# EAGLE design combined (EAGLE 9.6.2)

## Sheet 1 of 2
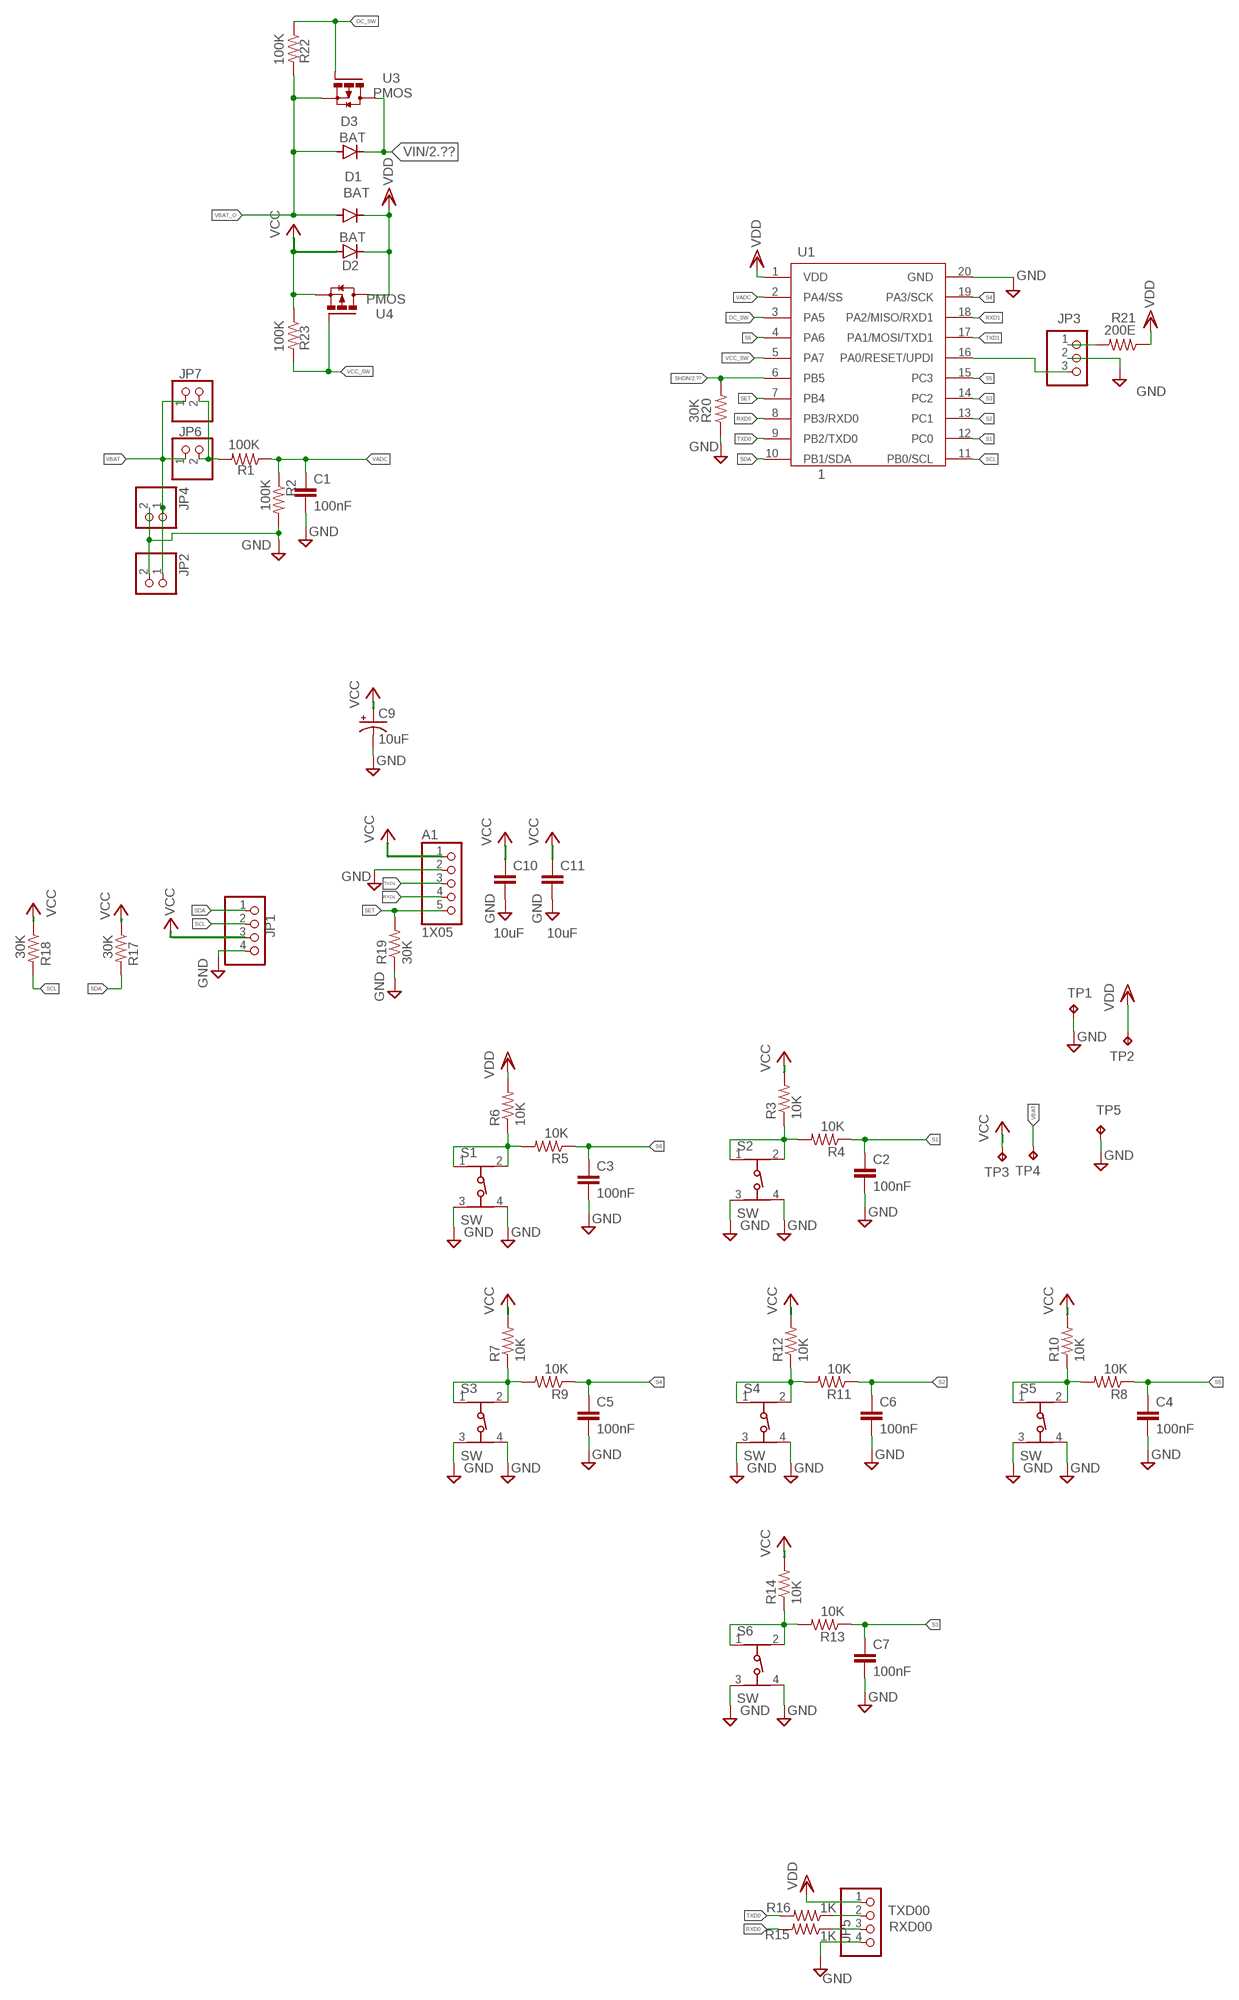
[diagram p0: schematic, sheet 1]

### Parts
A1  1X05  [1X05X254]
C1  100nF  C-EUC0805  [C0805]
C2  100nF  C-EUC0805  [C0805]
C3  100nF  C-EUC0805  [C0805]
C4  100nF  C-EUC0805  [C0805]
C5  100nF  C-EUC0805  [C0805]
C6  100nF  C-EUC0805  [C0805]
C7  100nF  C-EUC0805  [C0805]
C9  10uF  CPOL-USCT3528  [CT3528]
C10  10uF  C-EUC0805  [C0805]
C11  10uF  C-EUC0805  [C0805]
D1  BAT  CGRM4005-G  [SOD-123_MINI-SMA]
D2  BAT  CGRM4005-G  [SOD-123_MINI-SMA]
D3  BAT  CGRM4005-G  [SOD-123_MINI-SMA]
JP1  PINHD-1X04_2.54-S  [1X04-S]
JP2  PINHD-1X02_2.54-S  [1X02-S]
JP3  PINHD-1X03_2.54-S  [1X03-S]
JP4  PINHD-1X02_2.54-S  [1X02-S]
JP5  PINHD-1X04_2.54-S  [1X04-S]
JP6  PINHD-1X02_2.54-S  [1X02-S]
JP7  PINHD-1X02_2.54-S  [1X02-S]
R1  100K  R-US_R0805  [R0805]
R2  100K  R-US_R0805  [R0805]
R3  10K  R-US_R0805  [R0805]
R4  10K  R-US_R0805  [R0805]
R5  10K  R-US_R0805  [R0805]
R6  10K  R-US_R0805  [R0805]
R7  10K  R-US_R0805  [R0805]
R8  10K  R-US_R0805  [R0805]
R9  10K  R-US_R0805  [R0805]
R10  10K  R-US_R0805  [R0805]
R11  10K  R-US_R0805  [R0805]
R12  10K  R-US_R0805  [R0805]
R13  10K  R-US_R0805  [R0805]
R14  10K  R-US_R0805  [R0805]
R15  1K  R-US_R0805  [R0805]
R16  1K  R-US_R0805  [R0805]
R17  30K  R-US_R0805  [R0805]
R18  30K  R-US_R0805  [R0805]
R19  30K  R-US_R0805  [R0805]
R20  30K  R-US_R0805  [R0805]
R21  200E  R-US_R0805  [R0805]
R22  100K  R-US_R0805  [R0805]
R23  100K  R-US_R0805  [R0805]
S1  SW  SW_55MM  [SW_55MM]
S2  SW  SW_55MM  [SW_55MM]
S3  SW  SW_55MM  [SW_55MM]
S4  SW  SW_55MM  [SW_55MM]
S5  SW  SW_55MM  [SW_55MM]
S6  SW  SW_55MM  [SW_55MM]
TP1  GND  TPTP18R  [TP18R]
TP2  VDD  TPTP18R  [TP18R]
TP3  VCC  TPTP18R  [TP18R]
TP4  VBAT  TPTP18R  [TP18R]
TP5  GND  TPTP18R  [TP18R]
U1  1  ATTINY1616-SNR  [SOIC127P1032X265-20N]
U3  PMOS  DMP3165L  [SOT103P240X110-3N]
U4  PMOS  DMP3165L  [SOT103P240X110-3N]

### Nets
DC_SW: R22.1 U1.3(PA5) U3.1(G)
GND: A1.2 C1.2 C2.2 C3.2 C4.2 C5.2 C6.2 C7.2 C9.- C10.2 C11.2 JP1.4 JP2.2 JP3.2 JP4.2 JP5.4 R2.2 R19.1 R20.1 S1.3 S1.4 S2.3 S2.4 S3.3 S3.4 S4.3 S4.4 S5.3 S5.4 S6.3 S6.4 TP1.TP TP5.TP U1.20(GND) ; also sheet 2
N$1: R5.2 R6.1 S1.1 S1.2
N$2: JP3.3 U1.16(PA0/RESET/UPDI)
N$3: JP3.1 R21.2
N$5: R11.2 R12.1 S4.1 S4.2
N$8: R13.2 R14.1 S6.1 S6.2
N$9: R7.1 R9.2 S3.1 S3.2
N$10: R8.2 R10.1 S5.1 S5.2
N$12: R3.1 R4.2 S2.1 S2.2
RXD0: R15.2 U1.8(PB3/RXD0)
RXD00: JP5.3 R15.1
RXD1: A1.4 U1.18(PA2/MISO/RXD1)
S1: C2.1 R4.1 U1.12(PC0)
S2: C6.1 R11.1 U1.13(PC1)
S3: C7.1 R13.1 U1.14(PC2)
S4: C5.1 R9.1 U1.19(PA3/SCK)
S5: C4.1 R8.1 U1.15(PC3)
S6: C3.1 R5.1 U1.4(PA6)
SCL: JP1.2 R18.2 U1.11(PB0/SCL)
SDA: JP1.1 R17.2 U1.10(PB1/SDA)
SET: A1.5 R19.2 U1.7(PB4)
SHDN: R20.2 U1.6(PB5) ; also sheet 2
TXD0: R16.2 U1.9(PB2/TXD0)
TXD00: JP5.2 R16.1
TXD1: A1.3 U1.17(PA1/MOSI/TXD1)
VADC: C1.1 R1.1 R2.1 U1.2(PA4/SS)
VBAT: JP2.1 JP4.1 JP6.1 JP7.1 TP4.TP
VBAT_O: D1.A D3.A JP6.2 JP7.2 R1.2 R22.2 U3.2(S)
VCC: A1.1 C9.+ C10.1 C11.1 D2.A JP1.3 R3.2 R7.2 R10.2 R12.2 R14.2 R17.1 R18.1 R23.1 TP3.TP U4.2(S) ; also sheet 2
VCC_SW: R23.2 U1.5(PA7) U4.1(G)
VDD: D1.C D2.C JP5.1 R6.2 R21.1 TP2.TP U1.1(VDD) U4.3(D)
VIN: D3.C U3.3(D) ; also sheet 2

## Sheet 2 of 2: 1
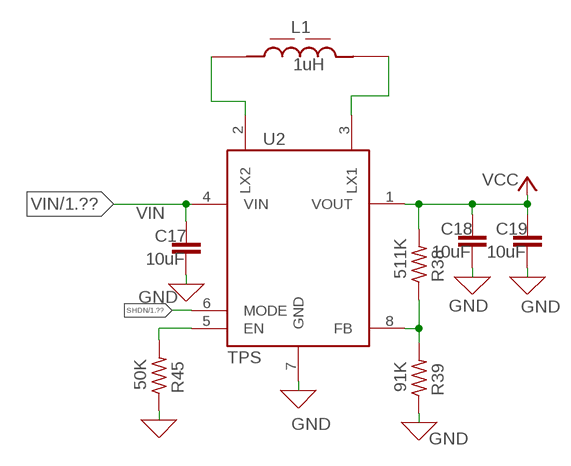
[diagram p1: schematic, sheet 2]

### Parts
C17  10uF  C-EUC0805  [C0805]
C18  10uF  C-EUC0805  [C0805]
C19  10uF  C-EUC0805  [C0805]
L1  1uH  5040_INDUCTOR  [IND_74404043220A]
R38  511K  R-US_M0805  [M0805]
R39  91K  R-US_M0805  [M0805]
R45  50K  R-US_M0805  [M0805]
U2  TPS  TPS563212DRLR  [SOTFL50P160X60-8N]

### Nets
GND: C17.2 C18.2 C19.2 R39.1 R45.1 U2.7(GND) ; also sheet 1
LX1: L1.2 U2.3(LX1)
LX2: L1.1 U2.2(LX2)
N$27: R38.1 R39.2 U2.8(FB)
N$36: R45.2 U2.5(EN)
SHDN: U2.6(MODE) ; also sheet 1
VCC: C18.1 C19.1 R38.2 U2.1(VOUT) ; also sheet 1
VIN: C17.1 U2.4(VIN) ; also sheet 1

## Library data of the parts
A1 = pinhead_smd:1X05
C1-C7 C10 C11 C17-C19 = rcl:C-EU: CAPACITOR, European symbol; SPICEPREFIX: C
C9 = rcl:CPOL-US: POLARIZED CAPACITOR, American symbol; SPICEPREFIX: C
D1-D3 = diode:CGRM400*-G: Molded plasitc,JEDEC SOD-123/Mini SMA Source: Comchip CGRM4001-G.pdf
JP1 JP5 = pinhead-2:PINHD-1X04: PIN HEADER
JP2 JP4 JP6 JP7 = pinhead-2:PINHD-1X02: PIN HEADER
JP3 = pinhead-2:PINHD-1X03: PIN HEADER
L1 = 5040_INDUCTOR:5040_INDUCTOR: WE-LQS SMT Power Inductor Check availability <https://pricing.snapeda.com/parts/74404043220A/Wurth%20Electronics/view-part?ref=eda>; AVAILABILITY: In Stock; CHECK_PRICES: https://www.snapeda.com/parts/74404043220A/Wurth+Electronics+Inc./view-part/?ref=eda; DESCRIPTION: 22 µH Semi-Shielded Wirewound Inductor 1.11 A 200mOhm Nonstandard; MF: Wurth Electronics; MP: 74404043220A; PACKAGE: Nonstandard Würth Elektronik; PRICE: None; PURCHASE-URL: https://www.snapeda.com/api/url_track_click_mouser/?unipart_id=703901&manufacturer=Wurth Electronics&part_name=74404043220A&search_term=744040; SNAPEDA_LINK: https://www.snapeda.com/parts/74404043220A/Wurth+Electronics+Inc./view-part/?ref=snap
R1-R23 R38 R39 R45 = rcl:R-US_: RESISTOR, American symbol; SPICEPREFIX: R
S1-S6 = switch_5p5mm:SW_55MM: Tactile Switches 50mA 12VDC, 2.5N 3.8mm H, G leads Source: Datasheet <https://www.ckswitches.com/media/2567/pts647.pdf> Check availability <https://pricing.snapeda.com/parts/PTS%20647%20SK38%20SMTR2%20LFS/C%26K/view-part?ref=eda>; AVAILABILITY: In Stock; CHECK_PRICES: https://www.snapeda.com/parts/PTS%20647%20SK38%20SMTR2%20LFS/C%2526K/view-part/?ref=eda; DESCRIPTION: Tactile Switch SPST-NO Top Actuated Surface Mount; MF: C&K; MP: PTS 647 SK38 SMTR2 LFS; PACKAGE: None; PRICE: None; PURCHASE-URL: https://www.snapeda.com/api/url_track_click_mouser/?unipart_id=4834952&manufacturer=C&amp;K&part_name=PTS 647 SK38 SMTR2 LFS&search_term=pts647; SNAPEDA_LINK: https://www.snapeda.com/parts/PTS%20647%20SK38%20SMTR2%20LFS/C%2526K/view-part/?ref=snap
TP1-TP5 = testpad:TP: Test pad
U1 = ATTINY1616-SNR:ATTINY1616-SNR: ATTiny1616 is a 20 pin Microcontroller with: - 5 selectable Voltage reference - 8 bit Dac - Multiplexable IOs(SPI, UART, I2C) And much more Datasheet <http://ww1.microchip.com/downloads/en/DeviceDoc/ATtiny1616-3216-DataSheet-DS40001997C.pdf> Check availability <https://pricing.snapeda.com/parts/ATTINY1616-SNR/Microchip%20Technology/view-part?ref=eda>; AVAILABILITY: In Stock; DESCRIPTION: AVR tinyAVR™ 1, Functional Safety (FuSa) Microcontroller IC 8-Bit 20MHz 16KB (16K x 8) FLASH 20-SOIC; MF: Microchip Technology; MP: ATTINY1616-SNR; PACKAGE: SOIC-20 Microchip; PRICE: None; PURCHASE-URL: https://pricing.snapeda.com/search/part/ATTINY1616-SNR/?ref=eda
U2 = TPS63000DRLR:TPS563212DRLR: Check availability <https://pricing.snapeda.com/parts/TPS563212DRLR/Texas%20Instruments/view-part?ref=eda>; AVAILABILITY: In Stock; CHECK_PRICES: https://www.snapeda.com/parts/TPS563212DRLR/Texas+Instruments/view-part/?ref=eda; DESCRIPTION: 4.2-V to 18-V, 3-A, 1.2-MHz, synchronous buck converter with eco-mode and selectable FCCM; MF: Texas Instruments; MP: TPS563212DRLR; PACKAGE: SOT-583 Texas Instruments; PRICE: None; PURCHASE-URL: https://www.snapeda.com/api/url_track_click_mouser/?unipart_id=9593796&manufacturer=Texas Instruments&part_name=TPS563212DRLR&search_term=sot-583; SNAPEDA_LINK: https://www.snapeda.com/parts/TPS563212DRLR/Texas+Instruments/view-part/?ref=snap
U3 U4 = DMP3165L:DMP3165L: P-CHANNEL ENHANCEMENT MODE MOSFET Check availability <https://pricing.snapeda.com/parts/DMP3130L-7/Diodes%20Inc./view-part?ref=eda>; AVAILABILITY: In Stock; CHECK_PRICES: https://www.snapeda.com/parts/DMP3130L-7/Diodes+Inc./view-part/?ref=eda; DESCRIPTION: P-Channel 30 V 3.5A (Ta) 700mW (Ta) Surface Mount SOT-23-3; MF: Diodes Inc.; MP: DMP3130L-7; PACKAGE: SOT-23 Diodes Inc.; PRICE: None; PURCHASE-URL: https://pricing.snapeda.com/search?q=DMP3130L-7&ref=eda; SNAPEDA_LINK: https://www.snapeda.com/parts/DMP3130L-7/Diodes+Inc./view-part/?ref=snap

## Net classes
0 default: width 0.254 mm, clearance 0.254 mm

## Board
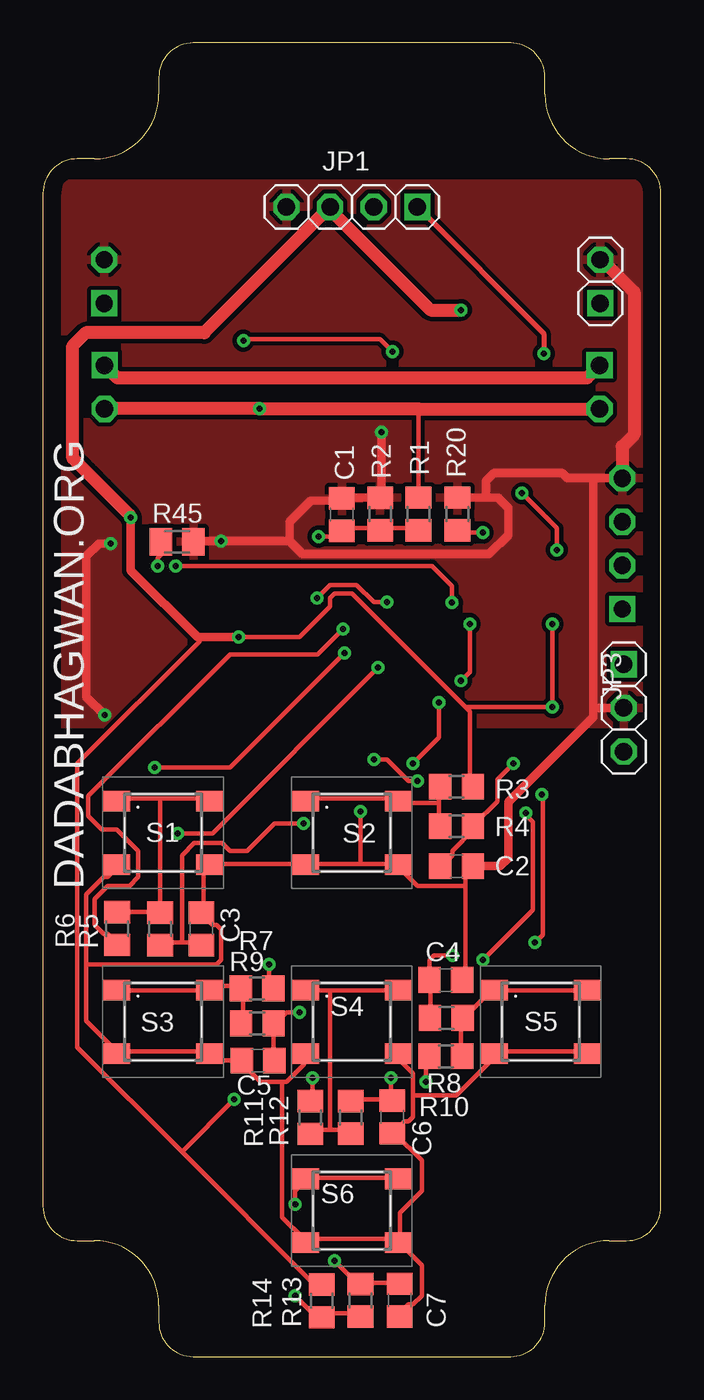
[diagram p2: board, top side]
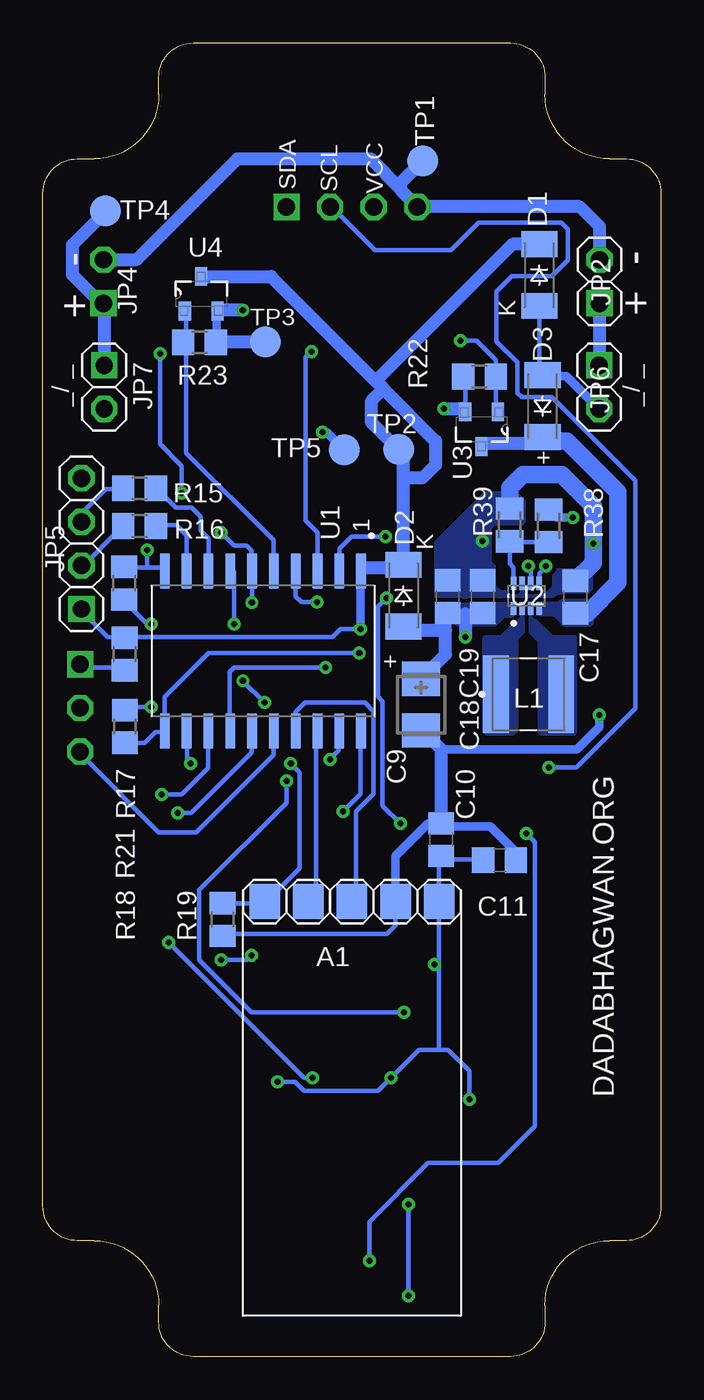
[diagram p3: board, bottom side, seen from below]

Size 36 x 76.5 mm. Coordinates in mm from the lower left corner, seen from the top.
Outline: 3,69.75 2,69.75 arc90 0,67.75 0,8.75 arc90 2,6.75 3,6.75 arc-90 6.75,3 6.75,2 arc90 8.75,0 27.25,0 arc90 29.25,2 29.25,3 arc-90 33,6.75 34,6.75 arc90 36,8.75 36,67.75 arc90 34,69.75 33,69.75 arc-90 29.25,73.5 29.25,74.5 arc90 27.25,76.5 8.75,76.5 arc90 6.75,74.5 6.75,73.5 arc-90 3,69.75
Copper layers (1*16): Top 0.035mm / dielectric 1.5mm / Bottom 0.035mm
Design rules "default *": minimum track width 8mil, minimum drill 0.35mm, track to track 8mil, track to pad 8mil, pad to pad 8mil, via to via 8mil, smd to smd 6mil, copper to edge 40mil, drill to drill 6mil, minimum pad ring 10mil, minimum via ring 8mil, stop-mask expansion 4mil, vias tented up to drill 0mil, thermal gap 10mil

### Footprints (pad centres in the part's own frame; a part is rotated, then mirrored left to right if it is on the bottom)
1X05X254 = smd 1.778 x 2.032: 1 -5.08,0; 2 -2.54,0; 3 0,0; 4 2.54,0; 5 5.08,0
C0805 = smd 1.3 x 1.5: 1 -0.95,0; 2 0.95,0
CT3528 = smd 2 x 2.2: + -1.5,0; - 1.5,0
SOD-123_MINI-SMA = smd 1.5 x 2.1: A 1.8,0; C -1.8,0
1X04-S = drill 1.016 square: 1 -3.81,0 | drill 1.016 octagon: 2 -1.27,0; 3 1.27,0; 4 3.81,0
1X02-S = drill 1.016 square: 1 -1.27,0 | drill 1.016 octagon: 2 1.27,0
1X03-S = drill 1.016 square: 1 -2.54,0 | drill 1.016 octagon: 2 0,0; 3 2.54,0
IND_74404043220A = smd 1.5 x 4.5: 1 -1.9,0; 2 1.9,0
R0805 = smd 1.3 x 1.5: 1 -0.95,0; 2 0.95,0
M0805 = smd 1.3 x 1.6: 1 -0.95,0; 2 0.95,0
SW_55MM = smd 1.55 x 1.2: 1 -2.7,1.85; 2 2.7,1.85; 3 -2.7,-1.85; 4 2.7,-1.85
TP18R = smd 1.8 x 1.8: TP 0,0
SOIC127P1032X265-20N = smd 2.05 x 0.6: 1 -4.655,5.715; 2 -4.655,4.445; 3 -4.655,3.175; 4 -4.655,1.905; 5 -4.655,0.635; 6 -4.655,-0.635; 7 -4.655,-1.905; 8 -4.655,-3.175; 9 -4.655,-4.445; 10 -4.655,-5.715; 11 4.655,-5.715; 12 4.655,-4.445; 13 4.655,-3.175; 14 4.655,-1.905; 15 4.655,-0.635; 16 4.655,0.635; 17 4.655,1.905; 18 4.655,3.175; 19 4.655,4.445; 20 4.655,5.715
SOTFL50P160X60-8N = smd 0.768 x 0.32: 1 -0.737,0.75; 2 -0.737,0.25; 3 -0.737,-0.25; 4 -0.737,-0.75; 5 0.737,-0.75; 6 0.737,-0.25; 7 0.737,0.25; 8 0.737,0.75
SOT103P240X110-3N = smd 1.1 x 0.711: 1 -1.016,0.95; 2 -1.016,-0.95; 3 1.016,0

### Placement (x,y rotation side)
A1  18,26.5 180 bottom
C1  17.41,49.03 90 top
C2  24.1,28.56 0 top
C3  9.23,24.9 90 top
C4  23.47,21.93 0 top
C5  12.53,17.24 180 top
C6  20.35,13.95 270 top
C7  20.78,3.29 270 top
C9  13.97,37.96 270 bottom
C10  12.8,30.1 90 bottom
C11  9.4,28.9 0 bottom
C17  4.98,44.23 90 bottom
C18  10.38,44.25 90 bottom
C19  12.42,44.25 90 bottom
D1  7.09,62.98 270 bottom
D2  15,44.31 270 bottom
D3  6.89,55.35 90 bottom
JP1  18,66.95 180 top
JP2  3.57,62.61 90 bottom
JP3  33.84,37.77 270 top
JP4  32.47,62.61 90 top
JP5  33.75,47.34 90 bottom
JP6  3.59,56.46 270 bottom
JP7  32.43,56.46 270 bottom
L1  7.71,38.57 0 bottom
R1  21.88,49.07 90 top
R2  19.65,49.06 90 top
R3  24.1,33.19 0 top
R4  24.1,30.89 180 top
R5  6.83,24.9 90 top
R6  4.32,24.92 270 top
R7  12.48,21.44 0 top
R8  23.5,19.72 0 top
R9  12.49,19.4 180 top
R10  23.47,17.49 180 top
R11  17.93,13.93 270 top
R12  15.58,13.92 90 top
R13  18.5,3.28 270 top
R14  16.25,3.24 90 top
R15  30.37,50.56 0 bottom
R16  30.37,48.36 0 bottom
R17  31.26,45.04 90 bottom
R18  31.22,36.69 270 bottom
R19  25.54,25.45 90 bottom
R20  24.15,49.07 270 top
R21  31.23,40.91 270 bottom
R22  10.56,57.06 180 bottom
R23  26.88,59.06 180 bottom
R38  6.54,48.38 90 bottom
R39  8.81,48.43 270 bottom
R45  7.82,47.45 180 top
S1  7,30.5 0 top
S2  18,30.5 0 top
S3  7,19.5 0 top
S4  18,19.5 0 top
S5  29,19.5 0 top
S6  18,8.5 0 top
TP1  13.87,69.62 0 bottom
TP2  15.26,52.82 270 bottom
TP3  23.04,59.08 0 bottom
TP4  32.35,66.73 180 bottom
TP5  18.45,52.79 0 bottom
U1  23.18,41.09 270 bottom
U2  7.83,44.3 90 bottom
U3  10.45,54 270 bottom
U4  26.78,61.89 90 bottom

### Tracks (layer width: path | path; a pad name or v marks a point on that pad's centre or on a via)
DC_SW  (via drill 0.35)
  Top 0.254: v20.36,58.53 19.65,59.24 11.76,59.24 v11.68,59.16
  Bottom 0.254: U3.1 9.62,55.1 9.62,56.88 R22.1 9.61,58.02 10.75,59.16 v11.68,59.16 | v20.36,58.53 20.7,58.19 20.7,48.69 20,47.99 U1.3
GND  (via drill 0.35)
  Top 0.254: 24.61,27.42 24.61,28.18 24.86,28.43 C2.2 | 24.61,27.42 24.61,22.08 C4.2 | 18.51,28.69 20.54,28.69 S2.4 20.8,28.43 21.81,27.42 24.61,27.42 | 18.51,28.69 15.46,28.69 S2.3 15.21,28.69 9.88,28.69 S1.4 9.62,28.43 9.37,28.18 9.37,25.89 C3.2 9.37,25.64 9.88,25.13 10.13,25.13 10.38,24.88 10.38,23.1 10.13,22.85 2.51,22.85 | 18.51,28.69 v18.51,31.74 | 13.94,15.99 12.67,15.99 11.65,17 C5.2 11.4,17.26 10.13,17.26 9.88,17.51 S3.4 9.62,17.77 4.54,17.77 S3.3 4.29,17.77 2.51,19.54 2.51,22.85 | 13.94,15.99 14.19,15.99 15.21,17 15.21,17.51 S4.3 | 2.51,22.85 2.51,26.91 3.53,27.93 3.78,27.93 4.29,28.43 S1.3 | C7.2 20.8,2.53 21.31,3.03 21.56,3.03 22.07,3.54 22.07,5.32 20.8,6.59 S6.4 | S6.4 20.54,6.84 15.46,6.84 S6.3 15.21,6.84 13.94,8.11 13.94,15.99 | 21.56,15.23 21.56,16.5 20.54,17.51 S4.4 | 21.56,15.23 21.56,13.96 21.31,13.7 21.05,13.7 C6.2 20.54,12.94 22.07,11.42 22.07,9.64 20.8,8.37 20.8,6.84 S6.4 | S5.4 31.47,17.77 26.39,17.77 S5.3 26.39,17.51 24.1,15.23 21.56,15.23 | R2.2 19.53,50.02 17.5,50.02 C1.2 17.24,49.77 | 24.35,50.02 R20.1
  Top 0.508: v3.94,47.35 3.27,47.35 2.53,46.61 2.53,38.42 v3.59,37.36 | v19.71,53.83 19.71,50.21 19.53,50.02 | R45.1 8.8,47.48 v10.38,47.48 14.36,47.48 | 25.8,50.02 26.51,50.02 27.11,49.42 27.11,47.85 25.99,46.73 15.11,46.73 14.36,47.48 | 25.8,50.02 24.35,50.02 | R2.2 17.48,50.01 17.24,49.77 | C1.2 17.28,49.85 15.62,49.85 14.36,48.59 14.36,47.48 | C2.2 26.66,28.56 27.12,29.02 27.12,32.3 32.06,37.24 32.06,37.9 | 33.74,51.16 | 25.8,50.02 25.8,50.98 26.27,51.45 30.26,51.45 30.55,51.16 32.06,51.16 | 32.06,51.16 33.74,51.16 | 32.06,51.16 32.06,37.9 | JP3.2 32.19,37.77 32.06,37.9
  Top 0.762: JP4.2 32.56,63.88 34.44,62 34.44,53.69 33.74,53 33.74,51.16 JP5.4
  Bottom 0.254: v18.51,31.74 17.5,32.75 17.5,36.31 U1.20 | R19.1 25.37,24.62 15.94,24.62 15.46,25.11 A1.2 | 13.95,36.37 C9.-
  Bottom 0.508: v3.59,37.36 3.57,37.34 3.57,36.66 4.88,35.35 12.79,35.35 | A1.2 15.46,29.16 13.57,31.05 C10.2 12.61,30.86 9.92,30.86 8.45,29.39 C11.2 | TP5.TP 19.49,53.83 v19.71,53.83
  Bottom 0.762: JP2.2 3.57,65.79 4.73,66.95 JP1.4 15.14,67.91 15.14,67.99 | C10.2 12.79,35.35 13.81,36.37 13.95,36.37 | JP4.2 30.53,63.88 24.66,69.75 16.9,69.75 15.14,67.99 | 15.14,67.99 15.14,68.35 TP1.TP
  Bottom 1.016: C17.2 3.94,46.22 v3.94,47.35 3.94,49.53 5.78,51.37 8.04,51.37 8.81,50.6 R39.1
  pour Bottom (isolate 0.2, rank 2, no thermals): 8.39,44.57 8.27,44.67 8.27,45.37 7.88,45.37 7.88,44.71 7.69,44.52 6.61,44.52 6.28,44.85 6.28,45.59 6.02,45.85 4.12,45.85 3.99,45.72 3.99,44.58 4.09,44.48 5.7,44.48 6.07,44.11 13.04,44.11 13.15,44.22 13.15,47.43 10.24,50.34 8.45,50.34 7.93,49.82 7.93,48.59 8.06,48.46 9.43,48.46 9.89,48 9.89,46.27 9.66,46.04 9.66,44.88 9.35,44.57
  pour Top (isolate 0.254): 1.04,68.31 1.04,36.84 35.1,36.84 35.1,68.31
LX1
  pour Bottom (isolate 0.1, no thermals): 7.49,43.89 7.67,43.89 7.67,42.17 7.14,41.64 7.14,36.36 6.97,36.19 5.07,36.19 4.93,36.33 4.93,41.88 5,41.95 6.32,41.95 7.48,43.11 7.48,43.88
LX2
  pour Bottom (no thermals): 8.14,43.13 8.14,43.9 7.98,43.9 7.98,42.17 8.37,41.78 8.37,36.44 8.61,36.2 10.14,36.2 10.38,36.44 10.38,41.83 10.26,41.95 9.32,41.95
N$1
  Top 0.254: 6.83,25.89 4.54,25.89 R6.1 | 6.83,32.5 9.62,32.5 S1.2 | 6.83,32.5 4.54,32.5 S1.1 | 6.83,32.5 6.83,25.89 | 6.83,25.89 R5.2
N$2
  Bottom 0.254: U1.16 22.58,36.31 22.58,35.04 27.08,30.53 29.25,30.53 33.75,35.04 JP3.3
N$3
  Bottom 0.254: R21.2 31.47,40.12 33.75,40.12 JP3.1
N$5
  Top 0.254: 16.73,13.19 17.75,13.19 R11.2 | 16.73,13.19 15.72,13.19 R12.1 | 16.73,21.32 20.54,21.32 S4.2 | 16.73,21.32 15.46,21.32 S4.1 | 16.73,21.32 16.73,13.19
N$8  (via drill 0.35)
  Top 0.254: R13.2 18.26,2.53 16.48,2.53 R14.1 16.23,2.53 15.72,2.53 v14.7,3.54 | S6.2 20.54,10.4 15.46,10.4 S6.1 15.21,10.15 14.7,9.64 v14.7,8.88
  Bottom 0.254: v14.7,8.88 v14.7,3.54
N$9
  Top 0.254: R9.2 11.65,19.54 11.65,21.32 R7.1 11.4,21.58 9.88,21.58 S3.2 9.62,21.32 4.54,21.32 S3.1
N$10
  Top 0.254: R10.1 24.35,17.51 24.35,19.54 R8.2 24.61,19.8 26.13,21.32 S5.1 26.39,21.32 31.47,21.32 S5.2
N$12
  Top 0.254: 23.08,32.24 23.08,33.01 R3.1 | 23.08,32.24 23.08,30.97 R4.2 | S2.1 15.46,32.5 20.54,32.5 S2.2 20.8,32.24 23.08,32.24
N$27
  Bottom 0.254: R38.1 8.76,47.43 R39.2 8.81,46.18 8.58,45.95 U2.8
N$36  (via drill 0.35)
  Top 0.254: v6.69,46.05 6.69,46.51 7.03,46.86 7.08,46.98 7.08,47.23 R45.2
  Bottom 0.254: v6.69,46.05 6.69,45.99 7.08,45.6 U2.5
RXD0
  Bottom 0.254: U1.8 26.34,45.75 26.34,47.64 26.81,48.11 26.81,48.91 27.34,49.44 28.28,49.44 29.41,50.56 R15.2
RXD00
  Bottom 0.254: R15.1 31.47,50.53 32.34,50.53 33.75,49.13 JP5.3
RXD1
  Bottom 0.254: A1.4 20.09,26.78 20.09,36.25 20.04,36.31 U1.18
S1  (via drill 0.35)
  Top 0.254: C2.1 23.34,28.69 23.85,29.2 23.85,29.45 25.12,30.72 R4.1 25.12,30.97 26.48,32.34 26.48,33.61 v27.4,34.53
  Bottom 0.254: v27.4,34.53 27.61,34.74 27.61,36.43 U1.12
S2  (via drill 0.35)
  Top 0.254: 20.29,14.97 18,14.97 R11.1 | v28.67,24.12 29.11,24.56 29.11,32.7 v29.07,32.74 | 20.29,14.97 v20.29,16.24 | 20.29,14.97 C6.1
  Bottom 0.254: v29.07,32.74 27.92,32.74 26.39,34.28 26.39,36.31 U1.13 | v28.67,24.12 20.8,16.24 v20.29,16.24
S3  (via drill 0.35)
  Top 0.254: C7.1 20.54,4.3 18.51,4.3 R13.1 18.26,4.3 v16.99,5.57 | v19.53,40.12 9.88,30.47 v7.84,30.47
  Bottom 0.254: v19.53,40.12 24.86,40.12 25.12,39.86 25.12,36.56 U1.14 | v7.84,30.47 7.34,29.96 7.34,13.4 9.47,11.27 13.58,11.27 16.99,7.86 v16.99,5.57
S4  (via drill 0.35)
  Top 0.254: C5.1 13.43,17.26 13.43,19.29 R9.1 13.69,19.54 14.19,20.05 v14.96,20.05 | v19.27,34.78 20.04,34.78 21.31,33.51 v21.81,33.51
  Bottom 0.254: v19.27,34.78 18.77,35.29 18.77,36.31 U1.19 | v21.81,33.51 21.81,32.24 26.89,27.16 26.89,23.1 23.85,20.05 v14.96,20.05
S5  (via drill 0.35)
  Top 0.254: R8.1 22.58,19.8 22.58,21.83 C4.1 22.52,23.08 22.79,23.35 v23.85,23.35 | v28.14,31.66 28.14,31.53 28.54,31.13 28.54,26.02 v25.62,23.1
  Bottom 0.254: v28.14,31.66 27.36,31.66 23.85,35.17 23.85,36.31 U1.15 | v25.62,23.1 24.1,23.1 v23.85,23.35
S6  (via drill 0.35)
  Top 0.254: 8.1,24.12 9.11,24.12 C3.1 | 8.1,24.12 7.08,24.12 R5.1 | v20.04,43.93 19.27,43.93 18.26,44.94 16.73,44.94 v15.97,44.18 | v15.18,31.04 13.5,31.04 11.91,29.45 10.89,29.45 10.44,29.9 8.81,29.9 8.1,29.2 8.1,24.12
  Bottom 0.254: v20.04,43.93 20.94,43.93 21.27,44.26 U1.4 | v15.97,44.18 16.48,43.67 16.48,38.43 16.2,38.15 16.2,32.06 v15.18,31.04
SCL  (via drill 0.35)
  Top 0.254: v17.57,40.98 10.91,34.32 v6.52,34.32
  Bottom 0.254: v6.52,34.32 4.93,34.32 1.49,37.75 1.49,51.02 6.34,55.87 8.1,55.87 8.35,56.12 8.35,57.9 9.57,59.12 9.57,62.01 8.67,62.91 6.36,62.91 5.41,63.86 5.41,65.64 5.8,66.03 10.63,66.03 12.23,64.43 16.67,64.43 19.02,66.79 JP1.2 | v17.57,40.98 26.34,40.98 28.89,38.42 U1.11 28.95,36.38 29.43,36.38 30.07,35.74 R18.2
SDA  (via drill 0.35)
  Top 0.254: v29.94,46.98 29.94,48.25 v27.91,50.28
  Top 0.305: JP1.1 29.18,59.58 v29.18,58.41
  Bottom 0.254: 29.94,45.96 28.93,45.96 U1.10 | 29.94,45.96 31.21,45.96 R17.2 | v29.94,46.98 29.94,45.96 | v27.91,50.28 27.91,51.86 29.18,53.13 v29.18,58.41
SET  (via drill 0.35)
  Top 0.254: v24.86,42.66 24.86,39.86 v24.35,39.36 | v23.08,38.09 23.08,36.05 v21.56,34.53
  Bottom 0.254: R19.2 25.37,26.4 23.08,26.4 A1.5 22.83,26.66 21.05,28.43 21.05,34.02 v21.56,34.53 | v24.86,42.66 24.86,45.71 U1.7 | v23.08,38.09 v24.35,39.36
SHDN  (via drill 0.35)
  Top 0.254: v25.62,47.99 24.35,47.99 R20.2 | v7.72,46.04 22.66,46.04 23.83,44.87 v23.83,43.9
  Bottom 0.254: v25.62,47.99 24.86,47.23 24.13,47.23 23.85,46.95 23.85,45.96 U1.6 23.81,43.91 v23.83,43.9 | U2.6 7.58,45.9 v7.72,46.04
TXD0
  Bottom 0.254: U1.9 27.62,47.82 28.22,48.42 29.36,48.42 R16.2
TXD00
  Bottom 0.254: R16.1 31.47,48.25 33.75,45.96 JP5.2
TXD1
  Bottom 0.254: A1.3 17.75,26.66 17.75,31.74 16.73,32.75 16.73,37.58 17.24,38.09 20.72,38.09 21.27,37.53 U1.17
VADC  (via drill 0.35)
  Top 0.254: R1.1 21.81,48.25 19.78,48.25 R2.1 19.53,48.25 17.5,48.25 C1.1 17.24,47.99 17.01,47.76 v16.05,47.76
  Bottom 0.254: v16.05,47.76 18.04,47.76 18.73,47.06 U1.2
VBAT
  Top 0.762: JP7.1 31.69,56.99 4.33,56.99 JP6.1
  Bottom 0.254: TP4.TP 32.48,66.53
  Bottom 0.762: JP2.1 3.59,61.32 JP6.1 | 32.48,66.53 34.29,64.73 34.29,63 32.63,61.34 JP4.1 32.43,61.3 JP7.1
VBAT_O  (via drill 0.35)
  Top 0.254: R1.2 21.88,55.19 | v12.63,55.2 v12.64,55.19
  Top 0.508: JP6.2
  Top 0.762: v12.64,55.19 21.88,55.19 JP7.2 | v12.63,55.2 JP6.2
  Bottom 0.254: D1.A 7.08,60.95 7.08,57.39 D3.A 6.89,57.1 | R22.2 11.4,56.88 U3.2 11.6,55.22 | v12.63,55.2 12.61,55.22
  Bottom 0.508: 6.89,57.1 5.5,57.1 JP6.2
  Bottom 0.762: 12.61,55.22 11.6,55.22
VCC  (via drill 0.35)
  Top 0.254: v15.72,16.24 15.72,14.97 R12.2 | v13.18,22.85 13.18,21.58 R7.2 | v22.32,15.99 22.32,17.26 R10.2 | 16.73,66.79 JP1.3 | 8.1,11.92 2,18.02 2,34.53 9.11,41.64 9.11,41.89 | 8.1,11.92 15.72,4.3 16.23,4.3 R14.2 | 24.61,37.83 18,44.44 16.99,44.44 16.73,44.18 16.73,43.67 14.96,41.9 v11.4,41.9 v11.4,41.89 | 24.61,37.83 24.86,37.58 24.86,33.26 R3.2 | 24.61,37.83 v29.69,37.83 v29.69,42.66 | 5.05,49.01 v5.12,48.86 | 8.1,11.92 v11.15,14.97
  Top 0.508: v5.12,48.86 5.12,45.77 9,41.89 9.11,41.89 v11.4,41.89
  Top 0.762: v24.35,60.95 22.58,60.95 16.73,66.79 | JP1.3 9.4,59.62 2.5,59.62 1.74,58.86 1.74,52.32 5.05,49.01
  Bottom 0.254: C11.1 10.38,28.94 12.67,28.94 C10.1 12.92,28.94 12.92,26.66 A1.1 12.92,26.4 12.92,22.85 | v15.72,16.24 14.1,17.86 12.92,17.86 12.92,22.85 | 12.92,22.85 v13.18,22.85 | v22.32,15.99 21.31,15.99 20.8,15.48 16.48,15.48 v15.72,16.24 | 25.88,60.69 U4.2 25.62,60.95 | 25.88,59.17 R23.1 | v29.69,37.83 31.21,37.83 R18.1 | v29.69,42.66 29.94,42.66 31.21,43.93 R17.1 | v15.72,16.24 14.09,17.87 12.39,17.87 11.15,16.63 v11.15,14.97
  Bottom 0.508: R38.2 6.07,48.86 v5.12,48.86 | 25.88,59.17 25.88,60.69
  Bottom 0.762: v24.35,60.95 25.62,60.95 | C9.+ 12.55,40.89 12.55,42.29 | 12.55,42.29 12.55,43.17 C19.1 | 11.4,43.26 v11.4,41.89 | 12.55,42.29 14.78,42.29 D2.A | TP3.TP 25.91,59.08 R23.1
  pour Bottom (isolate 0.2, no thermals): 8.96,43.9 8.47,43.9 8.45,43.88 8.45,43.3 8.67,43.08 9.13,43.08 9.65,42.56 11.82,42.56 11.84,42.54 13.17,43.84 9.68,43.84 9.64,43.88 8.98,43.88
VCC_SW
  Bottom 0.254: U4.1 27.66,60.69 27.66,59.17 R23.2 27.66,58.91 27.66,52.63 22.58,47.55 22.58,45.96 U1.5
VDD  (via drill 0.35)
  Top 0.254: v17.5,42.36 16.01,40.88 10.89,40.88 2.65,32.64 2.65,31.48 3.43,30.7 4.31,30.7 5.56,29.45 5.56,27.93 5.05,27.42 3.78,27.42 3.02,26.66 3.02,25.13 3.53,24.62 3.78,24.62 4.29,24.12 R6.2
  Bottom 0.254: 15.4,52.82 TP2.TP | JP5.1 33.75,43.42 32.23,41.9 31.47,41.9 R21.1 31.21,41.9 19.12,41.9 18.66,42.36 v17.5,42.36 | 17.5,45.71 U1.1 17.24,45.96 | 15.21,45.96 D2.C
  Bottom 0.508: 17.5,45.71 v17.5,42.36 | 15,52.42 15.4,52.82 | 14.99,51.16 15,51.17
  Bottom 0.762: 17.24,45.96 15.21,45.96 | D2.C 15,51.17 15,52.42 | U4.3 26.65,62.91 26.64,62.9 22.71,62.9 16.62,56.81 | 14.99,51.16 13.9,51.16 13.13,51.93 13.13,53.32 16.16,56.35 | 16.62,56.81 16.16,56.35 | TP2.TP 15.29,52.82 16.85,54.38 16.85,55.67 16.16,56.35 | D1.C 8.65,64.78 16.62,56.81
VIN
  Bottom 0.254: 7.25,53.16 7.08,53.33 D3.C 6.83,53.33 | 10.32,53.16 U3.3
  Bottom 0.508: C17.1 4.5,43.28
  Bottom 0.762: 7.25,53.16 10.32,53.16
  Bottom 1.016: C17.1 4.29,43.28 2.5,45.07 2.5,50.35 5.48,53.33 6.83,53.33
  pour Bottom (isolate 0.2, no thermals): 7.17,43.91 5.96,43.91 5.77,44.1 4.12,44.1 3.96,43.94 3.96,42.73 4.15,42.54 5.63,42.54 6.23,43.14 7.02,43.14 7.17,43.29

### Text on the board
tPlace: DADABHAGWAN.ORG
bPlace: VCC | SCL | SDA | - | - | + | K | + | _/ _ | _/ _ | + | 1 | K | + | DADABHAGWAN.ORG